# EAGLE design transmitter_with_sensor (EAGLE 9.6.2)
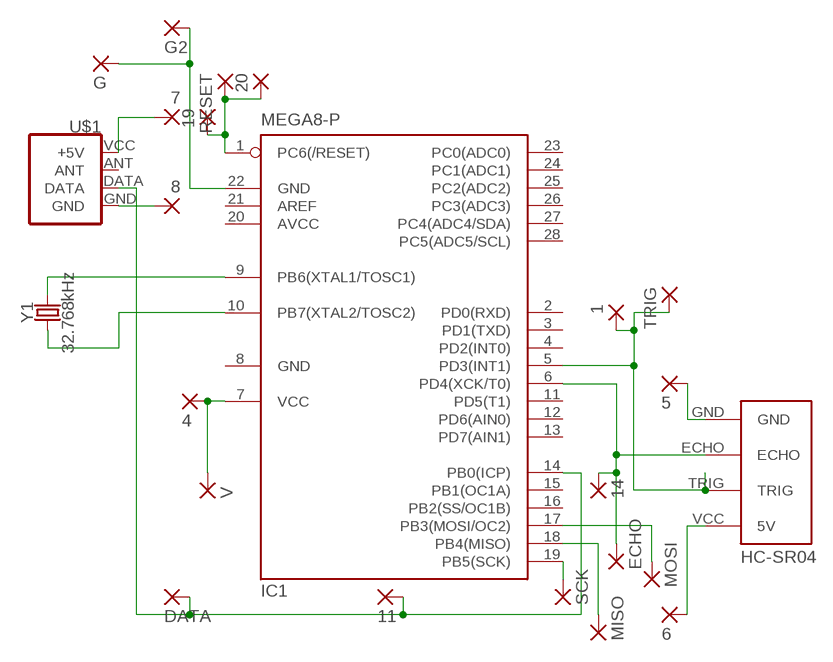
[diagram p0: schematic, sheet 1]

## Parts
1  WIREPAD1,6/0,8  [1,6/0,8]
4  WIREPAD1,6/0,8  [1,6/0,8]
5  WIREPAD1,6/0,8  [1,6/0,8]
6  WIREPAD1,6/0,8  [1,6/0,8]
7  WIREPAD1,6/0,8  [1,6/0,8]
8  WIREPAD1,6/0,8  [1,6/0,8]
11  WIREPAD1,6/0,8  [1,6/0,8]
14  WIREPAD1,6/0,8  [1,6/0,8]
19  WIREPAD1,6/0,8  [1,6/0,8]
20  WIREPAD1,6/0,8  [1,6/0,8]
DATA  WIREPAD1,6/0,8  [1,6/0,8]
ECHO  WIREPAD1,6/0,8  [1,6/0,8]
G  WIREPAD1,6/0,8  [1,6/0,8]
G2  WIREPAD1,6/0,8  [1,6/0,8]
IC1  MEGA8-P  [DIL28-3]
J_ULTRASONIC_1  HC-SR04  [HC-SR04_FOOTPRINT]
MISO  WIREPAD1,6/0,8  [1,6/0,8]
MOSI  WIREPAD1,6/0,8  [1,6/0,8]
RESET  WIREPAD1,6/0,8  [1,6/0,8]
SCK  WIREPAD1,6/0,8  [1,6/0,8]
TRIG  WIREPAD1,6/0,8  [1,6/0,8]
U$1  RF-LINK_TX  [RF-LINK_TX]
V  WIREPAD1,6/0,8  [1,6/0,8]
Y1  32.768kHz  CRYSTAL-32.768KHZPTH-2X6  [CRYSTAL-PTH-2X6-CYL]

## Nets
N$1: 6.1(P) J_ULTRASONIC_1.VCC(5V)
N$2: G2.1(P) G.1(P) IC1.22(GND)
N$3: 4.1(P) IC1.7(VCC) V.1(P)
N$4: 5.1(P) J_ULTRASONIC_1.GND
N$5: 8.1(P) U$1.GND
N$6: 7.1(P) U$1.VCC(+5V)
N$7: IC1.9(PB6(XTAL1/TOSC1)) Y1.2
N$8: IC1.10(PB7(XTAL2/TOSC2)) Y1.1
N$9: 19.1(P) 20.1(P) IC1.1(PC6(/RESET)) RESET.1(P)
N$10: 14.1(P) ECHO.1(P) IC1.6(PD4(XCK/T0)) J_ULTRASONIC_1.ECHO
N$11: 1.1(P) IC1.5(PD3(INT1)) J_ULTRASONIC_1.TRIG TRIG.1(P)
N$12: IC1.17(PB3(MOSI/OC2)) MOSI.1(P)
N$13: IC1.18(PB4(MISO)) MISO.1(P)
N$14: 11.1(P) DATA.1(P) IC1.14(PB0(ICP)) U$1.DATA
N$15: IC1.19(PB5(SCK)) SCK.1(P)
Unconnected: IC1.2(PD0(RXD)) IC1.3(PD1(TXD)) IC1.4(PD2(INT0)) IC1.11(PD5(T1)) IC1.12(PD6(AIN0)) IC1.13(PD7(AIN1)) IC1.15(PB1(OC1A)) IC1.16(PB2(SS/OC1B)) IC1.21(AREF) IC1.23(PC0(ADC0)) IC1.24(PC1(ADC1)) IC1.25(PC2(ADC2)) IC1.26(PC3(ADC3)) IC1.27(PC4(ADC4/SDA)) IC1.28(PC5(ADC5/SCL)) U$1.ANT

## Power pins joined to a net without a drawn wire
AVCC: IC1.20(AVCC)
GND: IC1.8(GND)

## Library data of the parts
1 4-8 11 14 19 20 DATA ECHO G G2 MISO MOSI RESET SCK TRIG V = wirepad:WIREPAD: Wire PAD connect wire on PCB
IC1 = atmel:MEGA8-P: MICROCONTROLLER 8 Kbytes FLASH, 1 kbytes SRAM, 512 bytes EEPROM, USART, 4-channel 10 bit ADC, 2-channel 8 bit ADC Pin compatible with Atmega48, ATMega88, ATMega168 Source: avr.lbr; OC_FARNELL: unknown; OC_NEWARK: unknown
J_ULTRASONIC_1 = Ultrasonic Sensor HC-SR04:HC-SR04: Ultrasonic Sensor HC-SR04
U$1 = SparkFun-RF:RF-LINK_TX: RF Link Transmitter (434 MHz, 315 MHz) These wireless transmitters work with equivalent receivers. They can easily fit into a breadboard and work well with microcontrollers to create a very simple wireless data link. Since these are only transmitters, they will only work communicating data one-way, you would need two pairs (of different frequencies) to act as a transmitter/receiver pair. SparkFun Products RF Link Transmitter - 434MHz <https://www.sparkfun.com/products/10534> (WRL-10534); SF_ID: WRL-10534
Y1 = SparkFun-Clocks:CRYSTAL-32.768KHZ: 32.768kHz Crystal Frequency: 32.768kHz Frequency Stability: ±20ppm Load Capacitance: 12.5pF (PTH-2X6 & SMD-3.2X1.5), 6pF (SMD-2X6) SparkFun Products: SparkFun BigTime Watch Kit <https://www.sparkfun.com/products/11734> SparkFun nRF52832 Breakout <https://www.sparkfun.com/products/13990> SparkFun Real Time Clock Module <https://www.sparkfun.com/products/12708>; PROD_ID: XTAL-10112

## Board
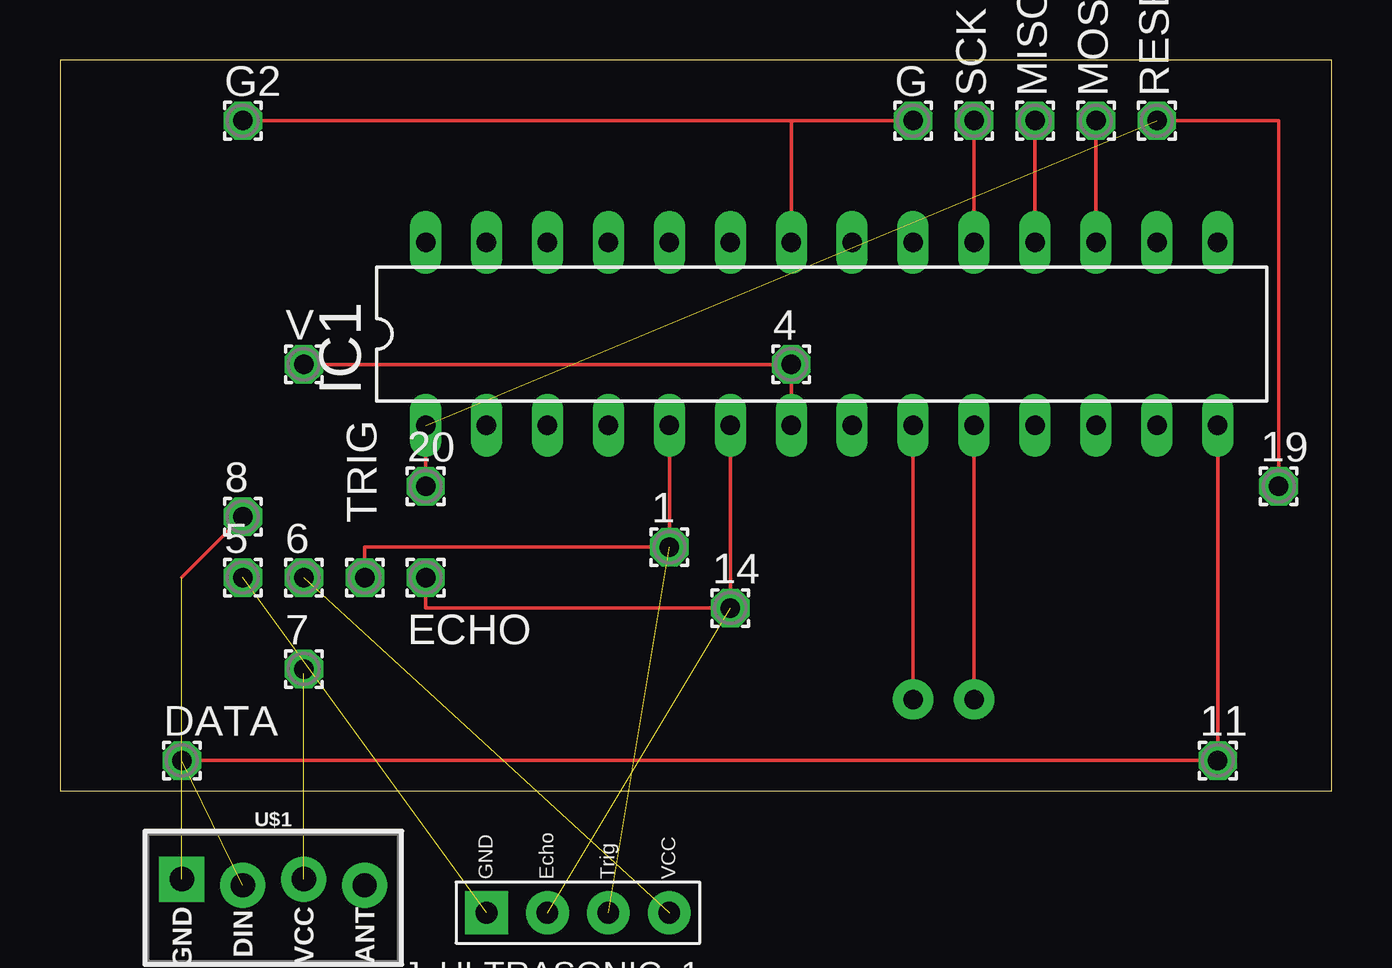
[diagram p1: board, top side]
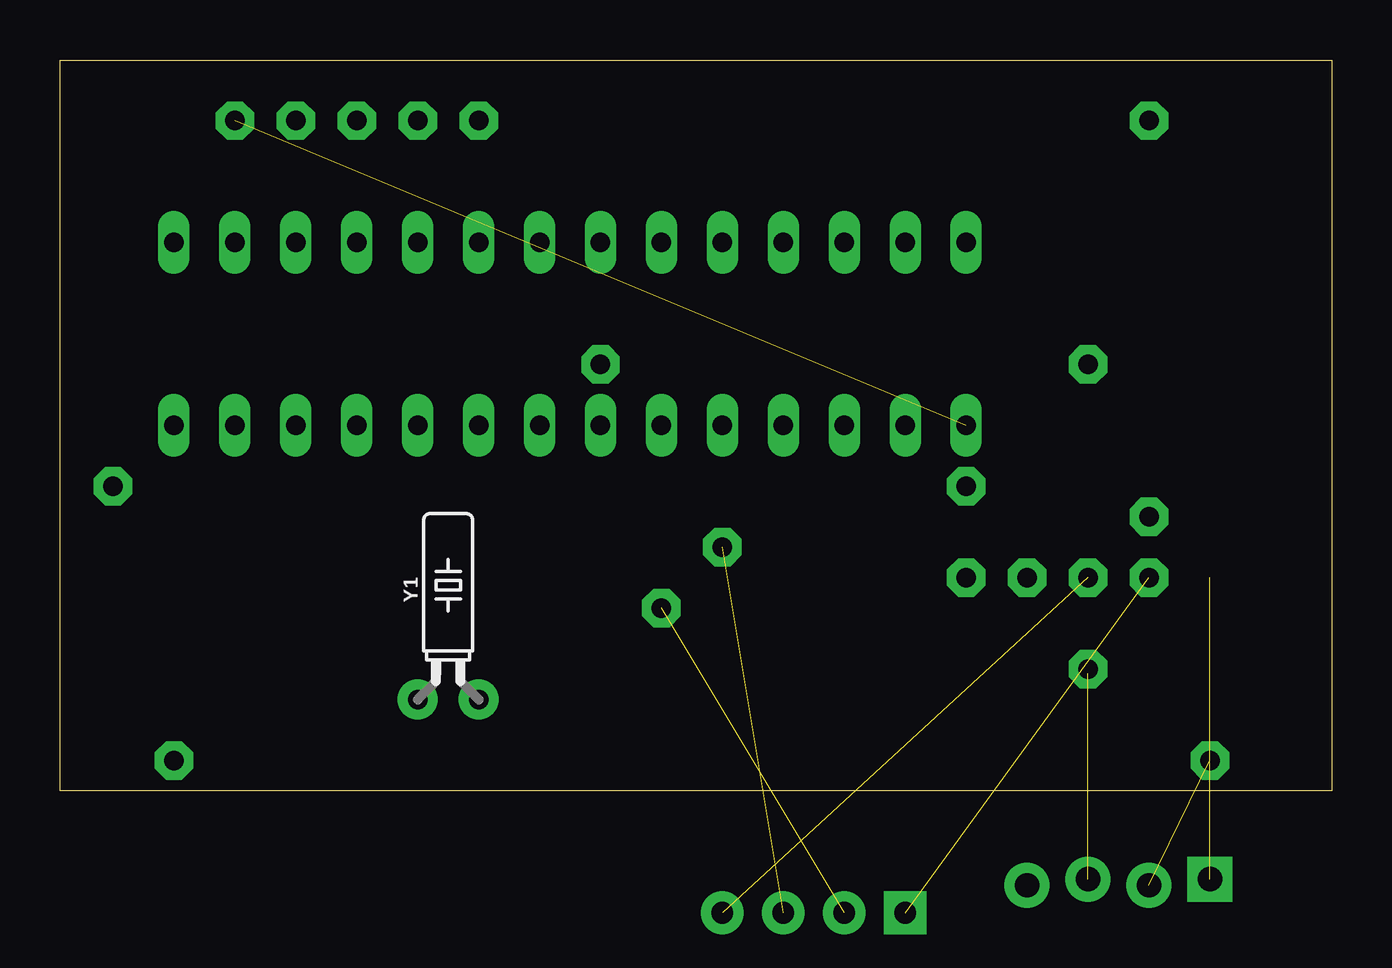
[diagram p2: board, bottom side, seen from below]

Size 53.01 x 30.47 mm. Coordinates in mm from the lower left corner, seen from the top.
Outline: 0,0 53.01,0 53.01,30.47 0,30.47 0,0
Copper layers (1*16): Top 0.035mm / dielectric 1.5mm / Bottom 0.035mm
Design rules "default": minimum track width 6mil, minimum drill 0.35mm, track to track 6mil, track to pad 6mil, pad to pad 6mil, via to via 6mil, smd to smd 6mil, copper to edge 40mil, drill to drill 6mil, minimum pad ring 10mil, minimum via ring 8mil, stop-mask expansion 4mil, vias tented up to drill 0mil, thermal gap 10mil

### Footprints (pad centres in the part's own frame; a part is rotated, then mirrored left to right if it is on the bottom)
1,6/0,8 = drill 0.813 pad 1.6 octagon: 1 0,0
DIL28-3 = drill 0.813 long: 1 -16.51,-3.81; 2 -13.97,-3.81; 3 -11.43,-3.81; 4 -8.89,-3.81; 5 -6.35,-3.81; 6 -3.81,-3.81; 7 -1.27,-3.81; 8 1.27,-3.81; 9 3.81,-3.81; 10 6.35,-3.81; 11 8.89,-3.81; 12 11.43,-3.81; 13 13.97,-3.81; 14 16.51,-3.81; 15 16.51,3.81; 16 13.97,3.81; 17 11.43,3.81; 18 8.89,3.81; 19 6.35,3.81; 20 3.81,3.81; 21 1.27,3.81; 22 -1.27,3.81; 23 -3.81,3.81; 24 -6.35,3.81; 25 -8.89,3.81; 26 -11.43,3.81; 27 -13.97,3.81; 28 -16.51,3.81
HC-SR04_FOOTPRINT = drill 0.9 pad 1.778: ECHO 0,1.27; TRIG 0,-1.27; VCC 0,-3.81 | drill 0.9 pad 1.778 square: GND 0,3.81
RF-LINK_TX = drill 1.016 pad 1.88: ANT 3.81,-0.127; DATA -1.27,-0.127; VCC 1.27,0.127 | drill 1.016 pad 1.88 square: GND -3.81,0.127
CRYSTAL-PTH-2X6-CYL = drill 0.813 pad 1.676: 1 -1.27,0; 2 1.27,0

### Placement (x,y rotation side)
1  25.4,10.16 0 top
4  30.48,17.78 0 top
5  7.62,8.89 0 top
6  10.16,8.89 0 top
7  10.16,5.08 0 top
8  7.62,11.43 0 top
11  48.26,1.27 0 top
14  27.94,7.62 0 top
19  50.8,12.7 0 top
20  15.24,12.7 0 top
DATA  5.08,1.27 0 top
ECHO  15.24,8.89 0 top
G  35.56,27.94 0 top
G2  7.62,27.94 0 top
IC1  31.75,19.05 0 top
J_ULTRASONIC_1  21.59,-5.08 90 top  (outside the outline)
MISO  40.64,27.94 0 top
MOSI  43.18,27.94 0 top
RESET  45.72,27.94 0 top
SCK  38.1,27.94 0 top
TRIG  12.7,8.89 0 top
U$1  8.89,-3.81 0 top  (outside the outline)
V  10.16,17.78 0 top
Y1  36.83,3.81 0 bottom

### Tracks (layer width: path | path; a pad name or v marks a point on that pad's centre or on a via)
N$1  (1 unrouted)
N$2
  Top 0.152: IC1.22 30.48,27.94 | G.1 30.48,27.94 | 30.48,27.94 G2.1
N$3
  Top 0.152: IC1.7 4.1 V.1
N$4  (1 unrouted)
N$5  (1 unrouted)
  Top 0.152: 8.1 5.08,8.89
N$6  (1 unrouted)
  Top 0.152: 7.1 10.16,4.89
N$7
  Top 0.152: Y1.2 IC1.9
N$8
  Top 0.152: Y1.1 IC1.10
N$9  (1 unrouted)
  Top 0.152: IC1.1 20.1 | 19.1 50.8,27.94 RESET.1
N$10  (1 unrouted)
  Top 0.152: IC1.6 14.1 15.24,7.62 ECHO.1
N$11  (1 unrouted)
  Top 0.152: IC1.5 1.1 12.7,10.16 TRIG.1
N$12
  Top 0.152: IC1.17 MOSI.1
N$13
  Top 0.152: IC1.18 MISO.1
N$14  (1 unrouted)
  Top 0.152: IC1.14 11.1 DATA.1
N$15
  Top 0.152: IC1.19 SCK.1